# Altium schematic sheet schematic.SchDoc
size A4
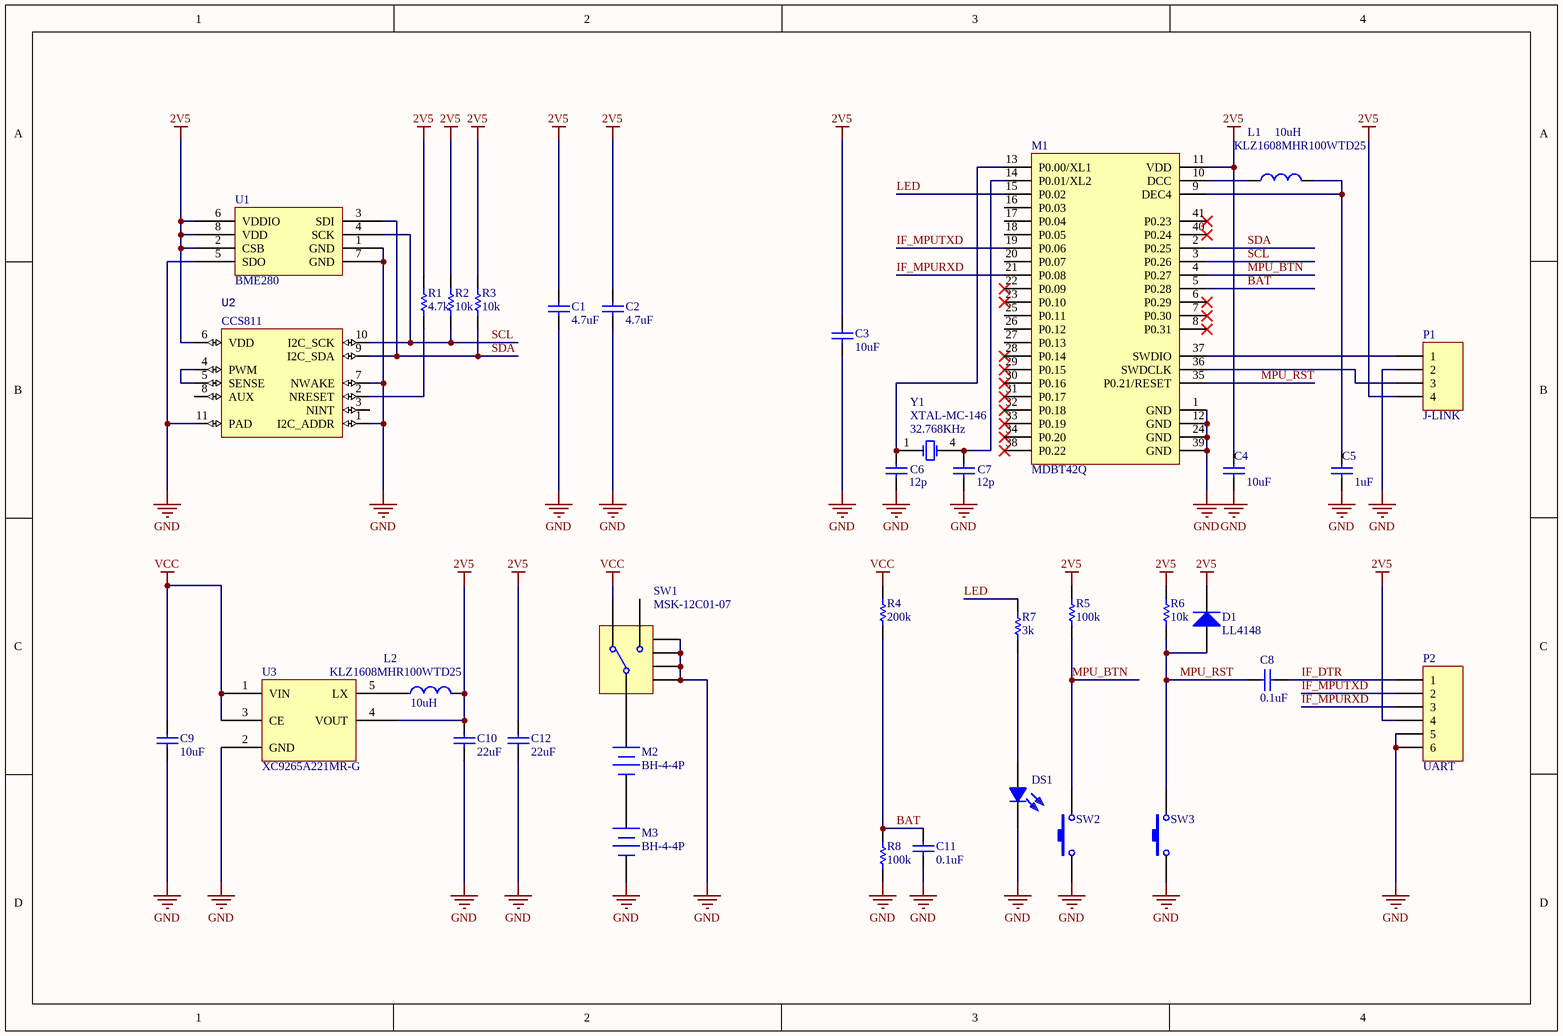
[diagram p0: schematic.SchDoc]

## Parts
C1  value 4.7uF  [1608[0603]]  (hidden comment: Cap1)
C2  value 4.7uF  [1608[0603]]  (hidden comment: Cap1)
C3  value 10uF  [1608[0603]]  (hidden comment: Cap1)
C4  value 10uF  [2012[0805]]  (hidden comment: Cap1)
C5  value 1uF  [1608[0603]]  (hidden comment: Cap1)
C6  value 12p  [1608[0603]]  (hidden comment: Cap1)
C7  value 12p  [1608[0603]]  (hidden comment: Cap1)
C8  value 0.1uF  [1608[0603]]  (hidden comment: Cap1)
C9  value 10uF  [Land2.54-2]  (hidden comment: Cap1)
C10  value 22uF  [Land2.54-2]  (hidden comment: Cap1)
C11  value 0.1uF  [1608[0603]]  (hidden comment: Cap1)
C12  value 22uF  [Land2.54-2]  (hidden comment: Cap1)
D1  LL4148  [SOD80]
DS1  (no value)  [3216[1206]+A]
L1  KLZ1608MHR100WTD25  value 10uH  [2012[0805]]
L2  KLZ1608MHR100WTD25  value 10uH  [2012[0805]]
M1  MDBT42Q  [MDBT42Q]
M2  BH-4-4P  [BH-4-4P]
M3  BH-4-4P  [BH-4-4P]
P1  J-LINK  [HDR1X4]
P2  UART  [HDR1X6]
R1  value 4.7k  [1608[0603]]  (hidden comment: Res)
R2  value 10k  [1608[0603]]  (hidden comment: Res)
R3  value 10k  [1608[0603]]  (hidden comment: Res)
R4  value 200k  [1608[0603]]  (hidden comment: Res)
R5  value 100k  [1608[0603]]  (hidden comment: Res)
R6  value 10k  [1608[0603]]  (hidden comment: Res)
R7  value 3k  [1608[0603]]  (hidden comment: Res)
R8  value 100k  [1608[0603]]  (hidden comment: Res)
SW1  MSK-12C01-07  [MSK-12C01-07]
SW2  TL3342F160QG  [TL3342F160QG]  (value not drawn)
SW3  TL3342F160QG  [TL3342F160QG]  (value not drawn)
U1  BME280  [BME280]
U2  CCS811  [LGA-10]
U3  XC9265A221MR-G
Y1  XTAL-MC-146  value 32.768KHz  [MC-146]

## Nets
2V5: C1.1 C2.1 C3.1 C4.2 C10.2 C12.2 D1.2(K) L2.2 M1.11(VDD) P1.4 P2.4 R1.1 R2.1 R3.1 R5.1 R6.1 U1.2(CSB) U1.6(VDDIO) U1.8(VDD) U2.6(VDD) U3.4(VOUT)
GND: C1.2 C2.2 C3.2 C4.1 C5.1 C6.1 C7.1 C9.1 C10.1 C11.2 C12.1 DS1.2 M1.1(GND) M1.12(GND) M1.24(GND) M1.39(GND) M3.2(-) P1.2 P2.5 P2.6 R8.2 SW1.4 SW1.5 SW1.6 SW1.7 SW2.1 SW3.1 U1.1(GND) U1.5(SDO) U1.7(GND) U2.1(I2C_ADDR) U2.7(NWAKE) U2.11(PAD) U3.2(GND)
VCC: C9.2 R4.1 SW1.1 U3.1(VIN) U3.3(CE)
BAT: C11.1 M1.5(P0.28) R4.2 R8.1
IF_DTR: C8.1 P2.1
IF_MPURXD: M1.21(P0.08) P2.3
IF_MPUTXD: M1.19(P0.06) P2.2
LED: M1.15(P0.02) R7.1
MPU_BTN: M1.4(P0.27) R5.2 SW2.3
MPU_RST: C8.2 D1.1(A) M1.35(P0.21/RESET) R6.2 SW3.3
SCL: M1.3(P0.26) R2.2 U1.4(SCK) U2.10(I2C_SCK)
SDA: M1.2(P0.25) R3.2 U1.3(SDI) U2.9(I2C_SDA)
NetC5_2: C5.2 L1.2 M1.9(DEC4)
NetC6_2: C6.2 M1.13(P0.00/XL1) Y1.1(OSC1)
NetC7_2: C7.2 M1.14(P0.01/XL2) Y1.4(OSC2)
NetDS1_1: DS1.1 R7.2
NetL1_1: L1.1 M1.10(DCC)
NetL2_1: L2.1 U3.5(LX)
NetM1_36: M1.36(SWDCLK) P1.3
NetM1_37: M1.37(SWDIO) P1.1
NetM2_1: M2.1(+) SW1.2
NetM2_2: M2.2(-) M3.1(+)
NetR1_2: R1.2 U2.2(NRESET)
NetU2_4: U2.4(PWM) U2.5(SENSE)

Not connected (* = marked no-connect by the designer): M1 6(P0.29)* 7(P0.30)* 8(P0.31)* 16(P0.03) 17(P0.04) 18(P0.05) 20(P0.07) 22(P0.09)* 23(P0.10)* 25(P0.11) 26(P0.12) 27(P0.13) 28(P0.14)* 29(P0.15)* 30(P0.16)* 31(P0.17)* 32(P0.18)* 33(P0.19)* 34(P0.20)* 38(P0.22)* 40(P0.24)* 41(P0.23)*; SW1 3; U2 3(NINT) 8(AUX)

## Library data of the parts
DS1 = LED: color: red
L1 = Inductor
L2 = Inductor: 1239AS-H-100M
P1 = Header 4: Header, 4-Pin; LatestRevisionDate: 17-Jul-2002; LatestRevisionNote: Re-released for DXP Platform.; Publisher: Altium Limited
P2 = Header 6: Header, 6-Pin; LatestRevisionDate: 17-Jul-2002; LatestRevisionNote: Re-released for DXP Platform.; Publisher: Altium Limited
U2 = CCS811: Manufacturer_Name: ams; GateName_1: G$1; SymbolName_1: CCS811; LibraryName: CCS811; DeviceSetName: CCS811; Manufacturer_Part_Number: CCS811; Mouser_Part_Number: 985-CCS811; Mouser_Price-Stock: http://www.mouser.com/Search/ProductDetail.aspx?qs=5Clb0NIqk7GQJ2C%252bUU%2fPyQ%3d%3d; Height: mm